# Altium project InvertingAmp.PrjPcb
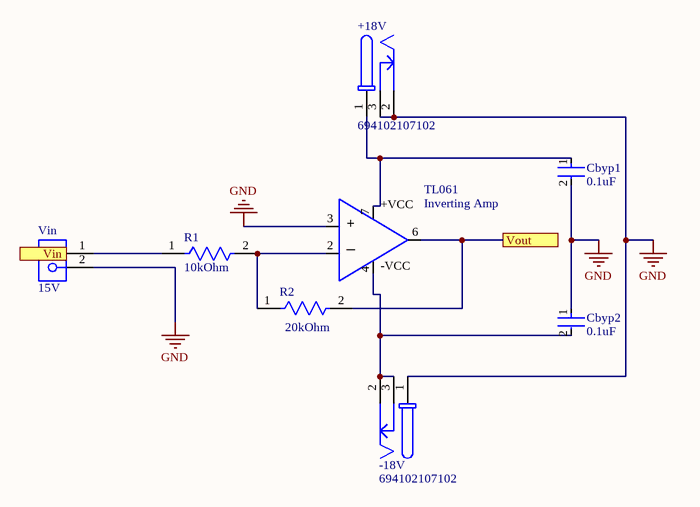
[diagram p0: TL061invertingamp.SchDoc]
2 sheets, 31 parts. Net scope: flat (ports and power ports of the same name join across sheets).
Board file: TL061main.PcbDoc
Sheets:
  TL061invertingamp.SchDoc
  Rechargeable Circuit.SchDoc

## Sheet TL061invertingamp.SchDoc
size A; SheetNumber: 1; SheetTotal: 1

### Parts
+18V  694102107102  [694102107102]
-18V  694102107102  [694102107102]
Cbyp1  0.1uF  [FP-CC0402-MFG]
Cbyp2  0.1uF  [FP-CC0402-MFG]
R1  10kOhm  [FP-MBB0207-MFG]
R2  20kOhm  [FP-MRS1600-MFG]
TL061  Inverting Amp  [TLC061ACD]
Vin  15V  [691408520002B]

### Ports
Vin, Vout

### Nets
GND: +18V.2 +18V.3 -18V.1 Cbyp1.2 Cbyp2.1 TL061.3 Vin.2
Net+18V_1: +18V.1 Cbyp1.1 TL061.7
Net-18V_2: -18V.2 -18V.3 Cbyp2.2 TL061.4
NetR1_1: R1.1 Vin.1
NetR1_2: R1.2 R2.1 TL061.2
NetR2_2: R2.2 TL061.6 ; port Vout

### Notes on the sheet
- (in symbol TL061ACD) +VCC; +; _; -VCC

### Library data of the parts
+18V -18V = CMP-1502-00174-2: NexarPartId: 52645180; Connector Type: Power; Insulation Resistance: 100MΩ; Gender: Male; Current Rating: 5A; Voltage Rating: 18V; Shielding: Unshielded; Mount: Surface Mount; Packaging: Tape and Reel; Max Operating Temperature: 85°C; Color: Black; Contact Plating: Tin; Min Operating Temperature: -40°C; Housing Material: Polyamide; Termination: SMD/SMT; RoHS: Compliant; Contact Gender: Female; REACH SVHC: Unknown; Voltage Rating (DC): 18V; Operating Supply Voltage: 18V; Flammability Rating: UL94 V-0
Cbyp1 Cbyp2 = CMP-03422-000048-1: CAP CER 0.1UF 16V X7R 0402; Manufacturer: YAGEO; Manufacturer Part Number: CC0402KRX7R7BB104; Automotive Grade: NA; Capacitance: 100 nF; Temperature Coefficient: 30ppm/°C; Tolerance: 0.1; Value: 100 nF; Device Class L1: Passive Components; Material: Ceramic; Temperature Range Low: -55°C; Device Class L3: Ceramic Capacitors; Temperature Characteristic: X7R; Ipc Land Pattern Name: CAPC10050X50; Temperature Range High: +125°C; Voltage Rating: 16 V; Temperature: -55°C to +125°C; RoHS: TRUE; Automotive: No; Height: 0.55mm; Device Class L2: Capacitors; Digikey Description: CAP CER 0.1UF 16V X7R 0402; Package: CC0402; Footprint Url: http://www.yageo.com/exep/pages/download/literatures/UPY-C_GEN_24.pdf; ComponentLink2Description: Datasheet; Category: Cap; Lead Free: Yes; Octopart: https://octopart.com/cc0402krx7r7bb104-yageo-42244624; ComponentLink2URL: http://www.yageo.com/documents/recent/UPY-GP_NP0_16V-to-50V_16.pdf; Mouser Description: 0402 0.1 uF 16 V ±10 % Tolerance X7R SMT Multilayer Ceramic Capacitor
R1 = CMP-02408-000035-1: RES 10K OHM 0.6W 1% AXIAL; Voltage Rating: 300V; Resistance: 10kR; Max Power Dissipation: 600mW; Temperature Coefficient: 50ppm/°C; Radiation Hardening: No; Case/Package: Conformal; Termination: Axial; Military Standard: Not; Length: 6.5mm; Voltage Rating (DC): 300V; RoHS Compliant: Yes; Number of Terminations: 2; Packaging: Tape and Reel; Features: Automotive AEC-Q200; Tolerance: 1%; Min Operating Temperature: -55°C; Power Rating: 600mW; Lead Free: Lead Free; Resistor Type: Metal Film; Construction: Cylindrical; Series: MBB 0207 - Professional; Max Operating Temperature: 155°C; Diameter: 2.5mm; Resistance Tolerance: 1%; Contact Plating: Tin; Technology: THIN FILM
R2 = CMP-02408-000019-1: RES 20K OHM 0.4W 1% AXIAL; Max Power Dissipation: 400mW; Temperature Coefficient: 50ppm/°C; Resistance: 20kR; Technology: THIN FILM; Max Operating Temperature: 155°C; Number of Terminations: 2; RoHS Compliant: Yes; Packaging: Tape and Reel; Radiation Hardening: No; Contact Plating: Tin; Military Standard: Not; Construction: Cylindrical; Diameter: 1.6mm; Tolerance: 1%; Mount: Through Hole; Power Rating: 400mW; Case/Package: Conformal; Termination: Axial; Length: 3.6mm; Min Operating Temperature: -55°C; Resistor Type: Metal Film; Series: MRS16
TL061 = TL061ACD
Vin = CMP-03913-118042523-1: 691408520002B Terminal Block, Wtb, 2WAY, 28-12AWG;; Voltage Rating: 300V; Number of Contacts: 2; Current Rating: 15A; Max Operating Temperature: 105°C; Number of Rows: 2; Height: 13.8mm; NexarPartId: 118042523; Min Operating Temperature: -40°C; Contact Material: Nickel, Tin

## Sheet Rechargeable Circuit.SchDoc
size B; SheetNumber: 1; SheetTotal: 1
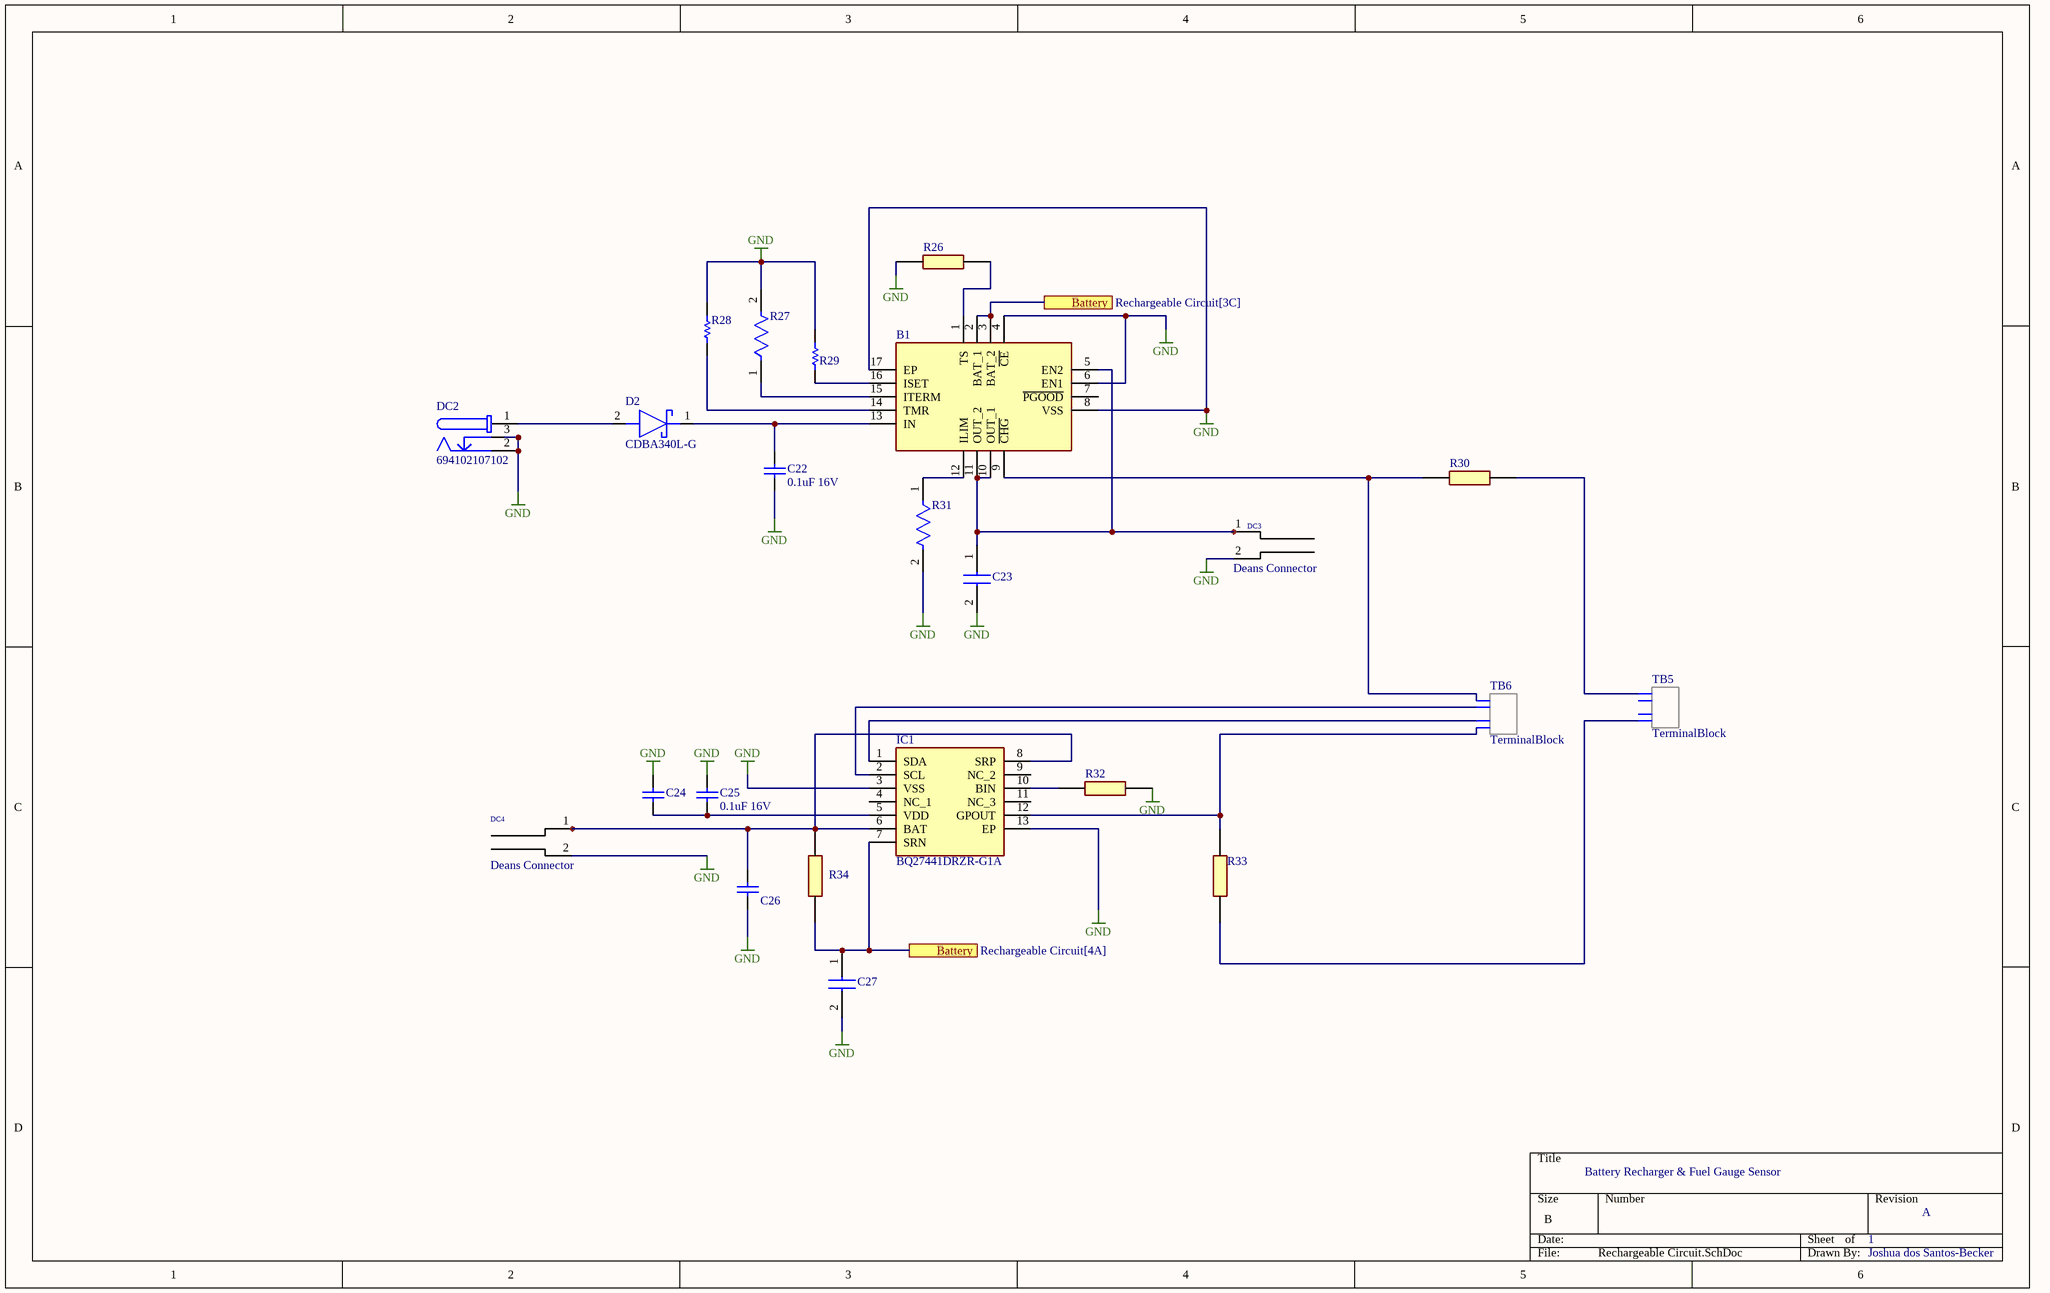
[diagram p1: Rechargeable Circuit.SchDoc]

### Parts
B1  BQ24232HRGTR  [QFN50P300X300X100-17N-D]  (value not drawn)
C22  0.1uF 16V  [CAPC2113X100X50ML30T10]
C23  GRM32DR71C106KA01L  [GRM32DR61C106KA01L]  (value not drawn)
C24  C1206C105K3RACTU  [CAPC3216X180X50ML20T25]  (value not drawn)
C25  0.1uF 16V  [CAPC2113X100X50ML30T10]
C26  C1206C105K3RACTU  [CAPC3216X180X50ML20T25]  (value not drawn)
C27  GRM32DR71C106KA01L  [GRM32DR61C106KA01L]  (value not drawn)
D2  CDBA340L-G  [DIONM5127X229N]
DC2  694102107102  [694102107102]
DC3  Deans Connector  [Deans]
DC4  Deans Connector  [Deans]
IC1  BQ27441DRZR-G1A  [BQ27441DRZRG1A]
R26  CRM2512QJW-103ELF  [RESC6331X80N]  (value not drawn)
R27  RG2012V-1431-B-T5  [FP-RG2012-MFG]  (value not drawn)
R28  CRCW120656K2FKEA  [RESC3216X60X45ML10T20]  (value not drawn)
R29  1K74 1% 2010(5025)  [RESC2010(5025)_L]  (value not drawn)
R30  CRM2512QJW-103ELF  [RESC6331X80N]  (value not drawn)
R31  CRCW08053K09FKEA  [FP-CRCW0805-e3-IPC_C]  (value not drawn)
R32  CRM2512QJW-103ELF  [RESC6331X80N]  (value not drawn)
R33  CRM2512QJW-103ELF  [RESC6331X80N]  (value not drawn)
R34  CRM2512QJW-103ELF  [RESC6331X80N]  (value not drawn)
TB5  TerminalBlock  [PHOENIX_1725672]
TB6  TerminalBlock  [PHOENIX_1725672]

### Ports
Battery (see Rechargeable Circuit[3C]), Battery (see Rechargeable Circuit[4A])

### Nets
GND: B1.4(~{CE}) B1.6(EN1) B1.8(VSS) B1.17(EP) C22.2 C23.2 C24.1 C25.1 C26.1 C27.2 DC2.2 DC2.3 DC3.2 DC4.2 IC1.3(VSS) IC1.13(EP) R26.1 R27.2 R28.1 R29.2 R31.2 R32.2
NetB1_1: B1.1(TS) R26.2
NetB1_2: B1.2(BAT_1) B1.3(BAT_2) C27.1 IC1.7(SRN) R34.1 ; port Battery
NetB1_5: B1.5(EN2) B1.10(OUT_1) B1.11(OUT_2) C23.1 DC3.1
NetB1_9: B1.9(~{CHG}) R30.1 TB6.1
NetB1_12: B1.12(ILIM) R31.1
NetB1_13: B1.13(IN) C22.1 D2.1(K)
NetB1_14: B1.14(TMR) R28.2
NetB1_15: B1.15(ITERM) R27.1
NetB1_16: B1.16(ISET) R29.1
NetC24_2: C24.2 C25.2 IC1.5(VDD)
NetC26_2: C26.2 DC4.1 IC1.6(BAT) IC1.8(SRP) R34.2
NetD2_2: D2.2(A) DC2.1
NetIC1_1: IC1.1(SDA) TB6.3
NetIC1_2: IC1.2(SCL) TB6.2
NetIC1_10: IC1.10(BIN) R32.1
NetIC1_12: IC1.12(GPOUT) R33.1 TB6.4
NetR30_2: R30.2 TB5.1
NetR33_2: R33.2 TB5.4

Not connected (* = marked no-connect by the designer): B1 7(~{PGOOD}); IC1 4(NC_1) 9(NC_2) 11(NC_3); TB5 2 3

### Notes on the sheet
- Battery Recharger & Fuel Gauge Sensor
- 1
- A
- Joshua dos Santos-Becker

### Library data of the parts
B1 = BQ24232HRGTR: USB-Friendly Lithium Based Battery Charger With Power-Path For 4.35V Batteries; Manufacturer_Name: Texas Instruments; Geometry.Height: 1mm; Mouser Part Number: 595-BQ24232HRGTR; Mouser Price/Stock: https://www.mouser.co.uk/ProductDetail/Texas-Instruments/BQ24232HRGTR?qs=sU0fTKI0LunTvrHzq76tZQ%3D%3D; Manufacturer_Part_Number: BQ24232HRGTR; Datasheet Link: http://www.ti.com/lit/gpn/bq24232h
C22 C25 = CMP-2007-00010-1: C0805X104K4RACTU; Manufacturer: Kemet; Part Number: C0805X104K4RACTU
C23 C27 = GRM32DR71C106KA01L: Capacitor; Manufacturer_Name: Murata Electronics; Datasheet Link: http://www.murata.com/~/media/webrenewal/support/library/catalog/products/capacitor/mlcc/c02e.pdf; Height: 2.2mm; Manufacturer_Part_Number: GRM32DR71C106KA01L; Mouser Part Number: 81-GRM32R71C106KA01L; Mouser Price/Stock: https://www.mouser.co.uk/ProductDetail/Murata-Electronics/GRM32DR71C106KA01L?qs=%2FV5QxPF79G3iRcxyZgnthw%3D%3D; Arrow Part Number: GRM32DR71C106KA01L; Arrow Price/Stock: https://www.arrow.com/en/products/grm32dr71c106ka01l/murata-manufacturing
C24 C26 = CMP-2000-04991-1: Chip Capacitor, 1 uF, +/- 10%, 25 V, -55 to 125 degC, 1206 (3216 Metric), RoHS, Tape and Reel; Manufacturer: Kemet; Temperature Coefficient / Code: +/-15%; Capacitance: 1uF; Dielectric: X7R; Voltage Rating DC: 25V; Capacitance - nF: 1000nF; Class: Class1; Case Length: 3.2mm; Type: SMDMLCCX7R6.3-250VDCCommericalGrade; Case Width: 1.6mm; Product: GeneralTypeMLCCs; Datasheet URL: https://ciiva.com/datasheet-click-18194173?src=ciiva&sig=6daff8c4; Operating Temperature Range: -55Cto+125C; Series: C1206C; RoHS: Details; Product Category: MultilayerCeramicCapacitorsMLCC-SMD/SMT; Manufacturer URL: http://www.kemet.com/; Minimum Operating Temperature: -55C; Dimensions: 1.6mmWx3.2mmLx1.6mmH; Termination Style: SMD/SMT; Brand: Kemet; Packaging: Reel; Package / Case: 1206(3216metric); Case Code - mm: 3216; Datasheet Version: Jul-14; Factory Pack Quantity: 2000; Package Description: 2-Pin Surface Mount Device, Body 3.2 x 1.6 mm; Tolerance: 10%; Package Reference: 1206; Case Height: 1.6mm; Case Code - in: 1206; Maximum Operating Temperature: +125C; Voltage Rating: 25V
D2 = CDBA340L-G: Schottky Diode; Manufacturer_Name: Comchip Technology; Datasheet Link: https://componentsearchengine.com/Datasheets/1/CDBA340L-G.pdf; Height: 2.29mm; Manufacturer_Part_Number: CDBA340L-G; Mouser Part Number: 750-CDBA340L-G; Mouser Price/Stock: https://www.mouser.co.uk/ProductDetail/Comchip-Technology/CDBA340L-G?qs=tw%252BuQ%2FB6PO0nFaxtl1KyCA%3D%3D; Arrow Part Number: CDBA340L-G; Arrow Price/Stock: https://www.arrow.com/en/products/cdba340l-g/comchip-technology?region=nac
DC2 = DC Power Jack: NexarPartId: 52645180; Connector Type: Power; Insulation Resistance: 100MΩ; Gender: Male; Current Rating: 5A; Voltage Rating: 18V; Shielding: Unshielded; Mount: Surface Mount; Packaging: Tape and Reel; Max Operating Temperature: 85°C; Color: Black; Contact Plating: Tin; Min Operating Temperature: -40°C; Housing Material: Polyamide; Termination: SMD/SMT; RoHS: Compliant; Contact Gender: Female; REACH SVHC: Unknown; Voltage Rating (DC): 18V; Operating Supply Voltage: 18V; Flammability Rating: UL94 V-0
IC1 = BQ27441DRZR-G1A: Integrated Circuit; Manufacturer_Name: Texas Instruments; Datasheet Link: http://www.ti.com/lit/gpn/bq27441-g1; Manufacturer_Part_Number: BQ27441DRZR-G1A; Mouser Part Number: 595-BQ27441DRZR-G1A; Mouser Price/Stock: https://www.mouser.co.uk/ProductDetail/Texas-Instruments/BQ27441DRZR-G1A?qs=vvk%2Fphg2gmMTlt0P9j2l8w%3D%3D; Arrow Part Number: BQ27441DRZR-G1A; Arrow Price/Stock: https://www.arrow.com/en/products/bq27441drzr-g1a/texas-instruments?region=nac
R26 R30 R32-R34 = CRM2512QJW-103ELF: ResPowerQ 2512 10k 5% 2W TC200; Manufacturer_Name: Bourns; Geometry.Height: 0.8mm; Mouser Part Number: 652-CRM2512QJW-103E; Mouser Price/Stock: https://www.mouser.co.uk/ProductDetail/Bourns/CRM2512QJW-103ELF?qs=8Wlm6%252BaMh8Rzg3bRHdWGsA%3D%3D; Manufacturer_Part_Number: CRM2512QJW-103ELF; Datasheet Link: http://www.bourns.com/data/global/pdfs/CRM0805_1206_2010.pdf
R27 = CMP-28537-000935-1: Automotive Metal Thin Film Chip Resistor, 0805, 1.43kΩ, 0.1%, 5ppm/°C, 0.125W, 150V; Power Rating: 125mW; Resistance: 1.43kR; Resistor Type: Thin Film; Package Quantity: 5000; Voltage Rating: 150V; Termination: SMD/SMT; Tolerance: 0.1%; Features: Automotive AEC-Q200; RoHS Compliant: Yes; Max Power Dissipation: 125mW; Weight: 0.000194oz; Series: RG; Case/Package: 0805; Height: 0.02inch; Width: 1.2mm; Lead Free: Lead Free; Min Operating Temperature: -55°C; Case Code (Metric): 2012; Temperature Coefficient: 5ppm/°C; Max Operating Temperature: 155°C; Packaging: Tape and Reel; Voltage Rating (DC): 150V; Number of Terminations: 2; Case Code (Imperial): 0805; Length: 0.079inch
R28 = CMP-2003-02284-1: Manufacturer: Vishay Dale; Part Number: CRCW120656K2FKEA
R29 = CMP-1017-00535-1: 1K74 0.75W 1% 2010 (5025 Metric)  SMD; Case-Metric: 5025; Case-EIA: 2010; Value: 1740.00 Ohm; Power: 0.75 W; Tolerance: 1 %; Technology: SMT
R31 = CMP-2001-03873-2: RES Thick Film, 3.09kΩ, 1%, 0.125W, 100ppm/°C, 0805; Max Power Dissipation: 125mW; Voltage Rating (DC): 150V; Resistance: 3.09kR; Power Rating: 125mW; Package Quantity: 10; Height: 0.02inch; Min Operating Temperature: -55°C; Number of Terminations: 2; Case Code (Metric): 2012; Case/Package: 0805; Composition: Thick Film; Max Operating Temperature: 155°C; Tolerance: 1%; Depth: 1.25mm; Number of Pins: 2; Packaging: Tape and Reel; Width: 0.049inch; Temperature Coefficient: 100ppm/°C; Voltage Rating: 150V; Military Standard: Not; Weight: 0.000194oz; Features: Automotive AEC-Q200; Case Code (Imperial): 0805; Radiation Hardening: No; Contact Plating: Tin; Lead Free: Lead Free; Length: 2mm; Termination: Solder

## Nets that join several sheets
GND: TL061invertingamp (7 pins), Rechargeable Circuit (22 pins)